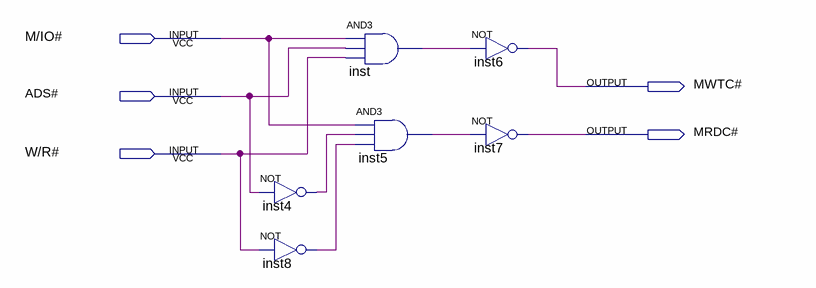
[diagram p0: schematic sheet]
// Quartus schematic controlsignalgenerator.bdf as structural Verilog: 6 symbols, 5 pins
module controlsignalgenerator (
  input  \M/IO# ,
  input  \ADS# ,
  input  \W/R# ,
  output \MWTC# ,
  output \MRDC# 
);

  wire inst4_out, inst5_out, inst8_out, inst_out;

  not inst4 (inst4_out, \ADS# );
  not inst8 (inst8_out, \W/R# );
  and inst (inst_out, \M/IO# , \ADS# , \W/R# );
  and inst5 (inst5_out, \M/IO# , inst4_out, inst8_out);
  not inst6 (\MWTC# , inst_out);
  not inst7 (\MRDC# , inst5_out);
endmodule
